# EAGLE design SparkFun-Blynk-Board-ESP8266 (EAGLE 7.5.0)
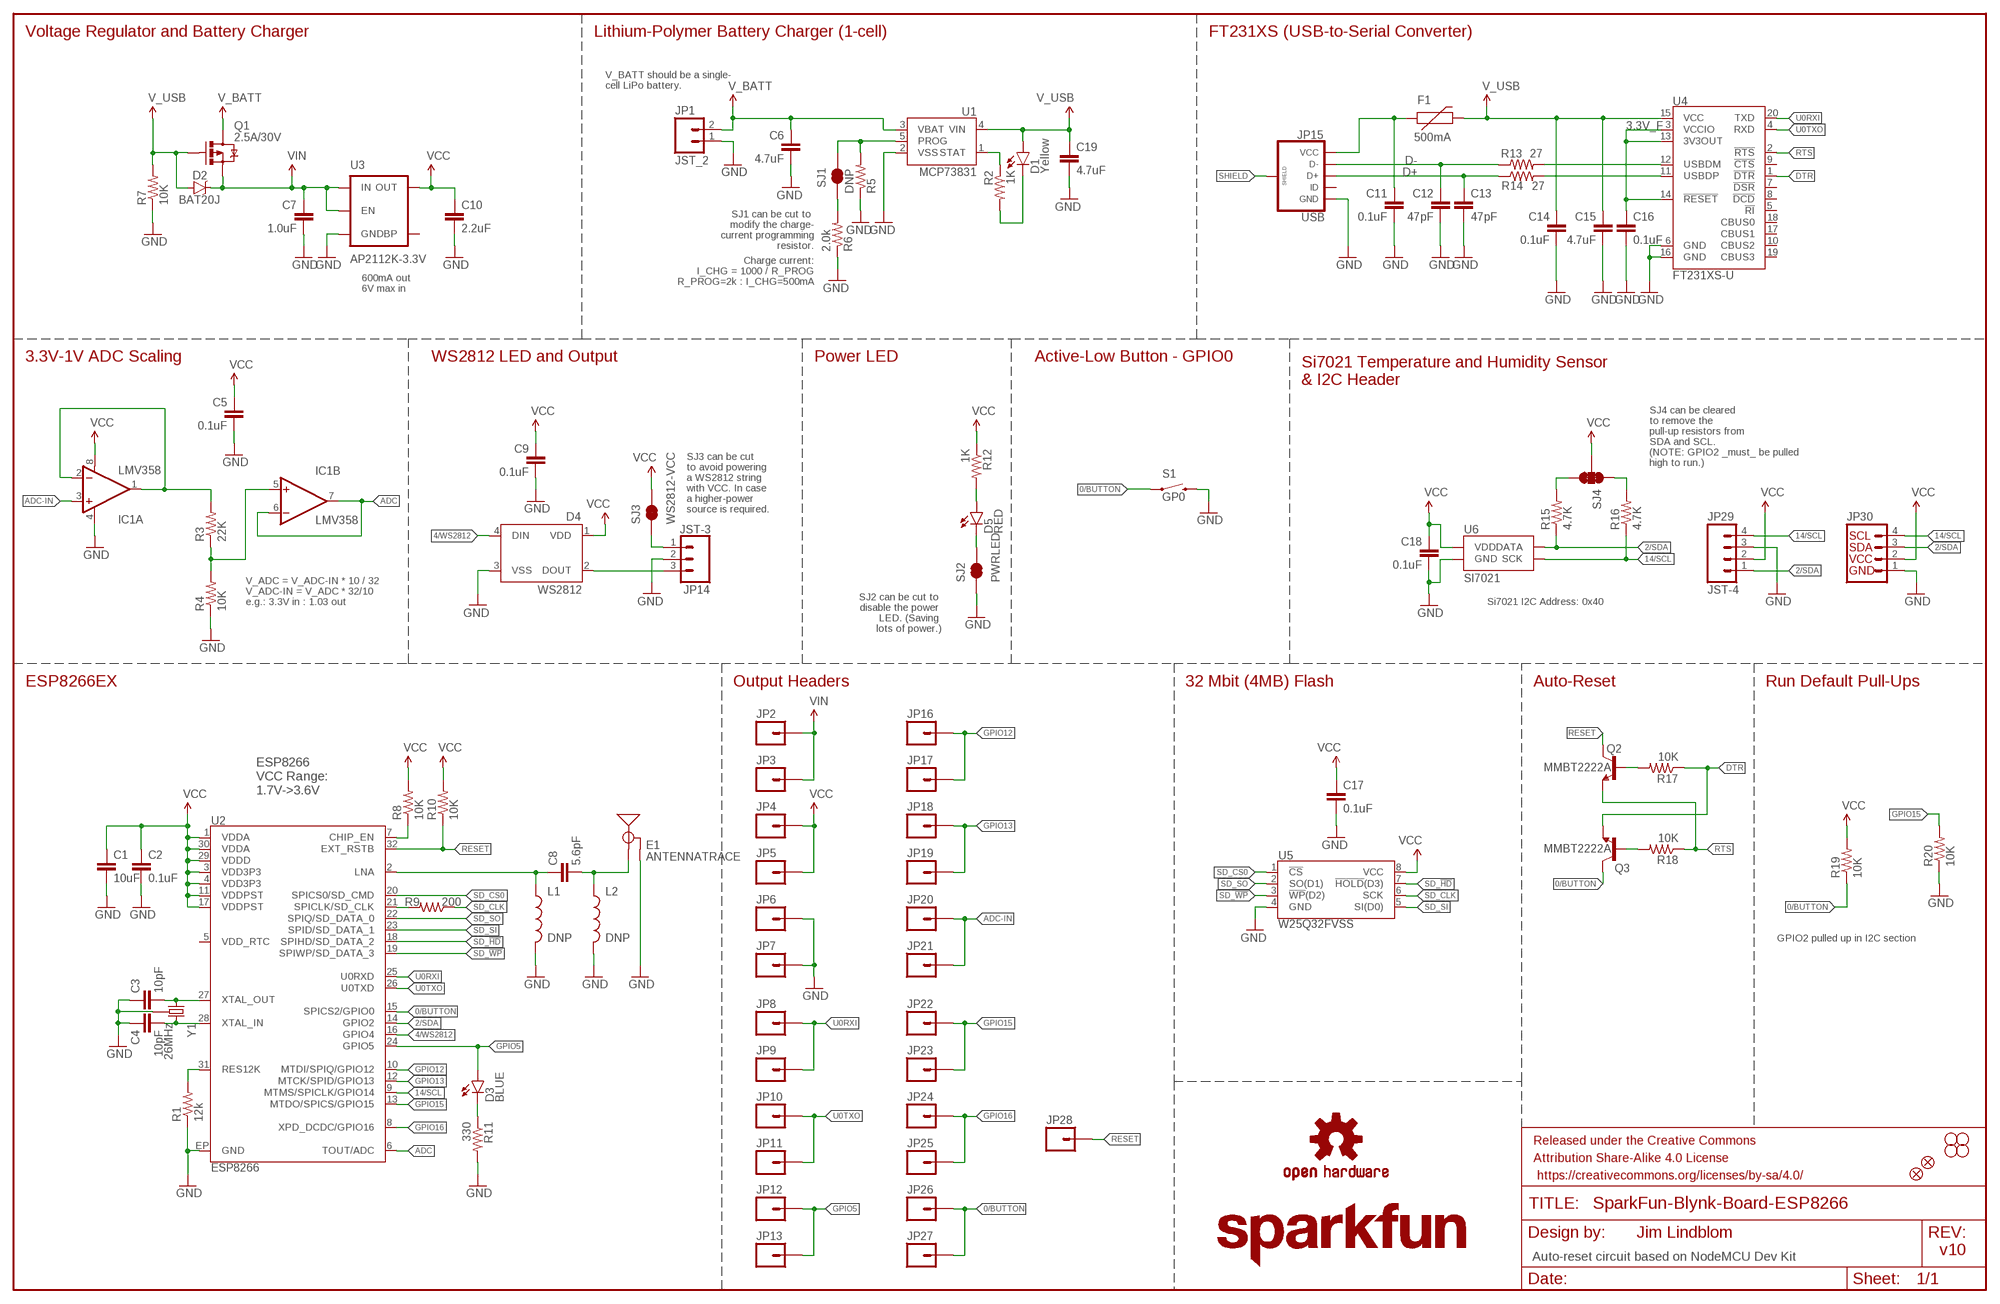
[diagram p0: schematic, sheet 1]

## Parts
C1  10uF  10UF-6.3V-20%(0603)  [0603-CAP]
C2  0.1uF  0.1UF-25V(+80/-20%)(0603)  [0603-CAP]
C3  10pF  10PF-50V-5%(0603)  [0603-CAP]
C4  10pF  10PF-50V-5%(0603)  [0603-CAP]
C5  0.1uF  0.1UF-25V(+80/-20%)(0603)  [0603-CAP]
C6  4.7uF  4.7UF-6.3V-10%(0603)0603  [0603-CAP]
C7  1.0uF  1.0UF-25V-+80/-20(0805)"  [0805-CAP]
C8  5.6pF  CAP0603-CAP  [0603-CAP]
C9  0.1uF  0.1UF-25V(+80/-20%)(0603)  [0603-CAP]
C10  2.2uF  2.2UF-10V-20%(0603)  [0603-CAP]
C11  0.1uF  0.1UF-25V(+80/-20%)(0603)  [0603-CAP]
C12  47pF  47PF-50V-5%(0603)  [0603-CAP]
C13  47pF  47PF-50V-5%(0603)  [0603-CAP]
C14  0.1uF  0.1UF-25V(+80/-20%)(0603)  [0603-CAP]
C15  4.7uF  4.7UF-6.3V-10%(0603)0603  [0603-CAP]
C16  0.1uF  0.1UF-25V(+80/-20%)(0603)  [0603-CAP]
C17  0.1uF  0.1UF-25V(+80/-20%)(0603)  [0603-CAP]
C18  0.1uF  0.1UF-25V(+80/-20%)(0603)  [0603-CAP]
C19  4.7uF  4.7UF-6.3V-10%(0603)0603  [0603-CAP]
D1  Yellow  LED-YELLOW0603  [LED-0603]
D2  BAT20J  DIODE-SCHOTTKY-BAT20J  [SOD-323]
D3  BLUE  LED-BLUE0603  [LED-0603]
D4  WS2812  WS2812B  [WS2812B]
D5  RED  LED-RED0603  [LED-0603]
E1  ANTENNATRACE  [TRACE_ANTENNA_2.4GHZ_25.7MM]
F1  500mA  PTCSMD  [PTC-1206]
FID1  FIDUCIAL1X2  [FIDUCIAL-1X2]
FID2  FIDUCIAL1X2  [FIDUCIAL-1X2]
FRAME1  FRAME-LEDGER  [CREATIVE_COMMONS]
IC1  LMV358  OPAMP-DUALU  [SO08]
JP1  JST_2  M02JST-PTH-2  [JST-2-PTH]
JP2  DNP  M01ALLIGATOR_HALF  [1X01_ALLIGATOR_3MM_HALF]
JP3  DNP  M01PTH_NO_SILK_YES_STOP  [1X01_NO_SILK]
JP4  DNP  M01ALLIGATOR_HALF  [1X01_ALLIGATOR_3MM_HALF]
JP5  DNP  M01PTH_NO_SILK_YES_STOP  [1X01_NO_SILK]
JP6  DNP  M01ALLIGATOR_HALF  [1X01_ALLIGATOR_3MM_HALF]
JP7  DNP  M01PTH_NO_SILK_YES_STOP  [1X01_NO_SILK]
JP8  DNP  M01ALLIGATOR_HALF  [1X01_ALLIGATOR_3MM_HALF]
JP9  DNP  M01PTH_NO_SILK_YES_STOP  [1X01_NO_SILK]
JP10  DNP  M01ALLIGATOR_HALF  [1X01_ALLIGATOR_3MM_HALF]
JP11  DNP  M01PTH_NO_SILK_YES_STOP  [1X01_NO_SILK]
JP12  DNP  M01ALLIGATOR_HALF  [1X01_ALLIGATOR_3MM_HALF]
JP13  DNP  M01PTH_NO_SILK_YES_STOP  [1X01_NO_SILK]
JP14  JST-3  M03JST-PTH-VERT  [JST-3-PTH-VERT]
JP15  USB  USB_MICROB_PLUGCONN-11752  [USB-B-MICRO-SMD_V03]
JP16  DNP  M01ALLIGATOR_HALF  [1X01_ALLIGATOR_3MM_HALF]
JP17  DNP  M01PTH_NO_SILK_YES_STOP  [1X01_NO_SILK]
JP18  DNP  M01ALLIGATOR_HALF  [1X01_ALLIGATOR_3MM_HALF]
JP19  DNP  M01PTH_NO_SILK_YES_STOP  [1X01_NO_SILK]
JP20  DNP  M01ALLIGATOR_HALF  [1X01_ALLIGATOR_3MM_HALF]
JP21  DNP  M01PTH_NO_SILK_YES_STOP  [1X01_NO_SILK]
JP22  DNP  M01ALLIGATOR_HALF  [1X01_ALLIGATOR_3MM_HALF]
JP23  DNP  M01PTH_NO_SILK_YES_STOP  [1X01_NO_SILK]
JP24  DNP  M01ALLIGATOR_HALF  [1X01_ALLIGATOR_3MM_HALF]
JP25  DNP  M01PTH_NO_SILK_YES_STOP  [1X01_NO_SILK]
JP26  DNP  M01ALLIGATOR_HALF  [1X01_ALLIGATOR_3MM_HALF]
JP27  DNP  M01PTH_NO_SILK_YES_STOP  [1X01_NO_SILK]
JP28  DNP  M01PTH_NO_SILK_YES_STOP  [1X01_NO_SILK]
JP29  JST-4  M04JST-PTH-VERT  [JST-4-PTH-VERT]
JP30  DNP  I2C_STANDARD_NO_SILK  [1X04_NO_SILK]
L1  DNP  INDUCTOR0603  [0603]
L2  DNP  INDUCTOR0603  [0603]
LOGO1  SFE_LOGO_NAME.2_INCH  [SFE_LOGO_NAME_.2]
LOGO2  OSHW-LOGOS  [OSHW-LOGO-S]
LOGO3  SFE_LOGO_NAME.3_INCH  [SFE_LOGO_NAME_.3]
Q1  2.5A/30V  MOSFET-PCHANNELDMG2307L  [SOT23-3]
Q2  MMBT2222A  TRANSISTOR_NPNMMBT2222A  [SOT23-3@1]
Q3  MMBT2222A  TRANSISTOR_NPNMMBT2222A  [SOT23-3@1]
R1  12k  12KOHM-1/10W-1%(0603)  [0603-RES]
R2  1K  1KOHM-1/10W-1%(0603)  [0603-RES]
R3  22K  22KOHM1/10W1%(0603)  [0603-RES]
R4  10K  10KOHM-1/10W-1%(0603)0603  [0603-RES]
R5  DNP  RESISTORPTH-1/6W  [1/6W-RES]
R6  2.0k  2.0KOHM1/10W5%(0603)  [0603-RES]
R7  10K  10KOHM1/10W1%(0603)0603  [0603-RES@1]
R8  10K  10KOHM1/10W1%(0603)0603  [0603-RES@1]
R9  200  200OHM1/10W1%(0603)  [0603-RES]
R10  10K  10KOHM1/10W1%(0603)0603  [0603-RES@1]
R11  330  330OHM1/10W1%(0603)  [0603-RES]
R12  1K  1KOHM-1/10W-1%(0603)  [0603-RES]
R13  27  27OHM1/10W1%(0603)0603-RES  [0603-RES]
R14  27  27OHM1/10W1%(0603)0603-RES  [0603-RES]
R15  4.7K  4.7KOHM-1/10W-1%(0603)  [0603-RES]
R16  4.7K  4.7KOHM-1/10W-1%(0603)  [0603-RES]
R17  10K  10KOHM1/10W1%(0603)0603  [0603-RES@1]
R18  10K  10KOHM1/10W1%(0603)0603  [0603-RES@1]
R19  10K  10KOHM1/10W1%(0603)0603  [0603-RES@1]
R20  10K  10KOHM1/10W1%(0603)0603  [0603-RES@1]
S1  GP0  SWITCH-MOMENTARY-2SMD-REDUNDANT  [TACTILE-SWITCH-SMD]
SJ1  DNP  JUMPER-PAD-2-NC_BY_TRACE  [PAD-JUMPER-2-NC_BY_TRACE_YES_SILK]
SJ2  PWRLED  JUMPER-PAD-2-NC_BY_TRACE  [PAD-JUMPER-2-NC_BY_TRACE_YES_SILK]
SJ3  WS2812-VCC  JUMPER-PAD-2-NC_BY_TRACE  [PAD-JUMPER-2-NC_BY_TRACE_YES_SILK]
SJ4  DNP  JUMPER-PAD-3-NC_BY_TRACE  [PAD-JUMPER-3-3OF3_NC_BY_TRACE_YES_SILK_FULL_BOX]
STANDOFF1  STAND-OFF  [STAND-OFF]
STANDOFF2  STAND-OFF  [STAND-OFF]
STANDOFF3  STAND-OFF  [STAND-OFF]
STANDOFF4  STAND-OFF  [STAND-OFF]
U1  MCP73831  [SOT23-5]
U2  ESP8266  [QFN32]
U3  AP2112K-3.3V  V_REG_LDOSMD  [SOT23-5]
U4  FT231XS-U  FT231XS  [SSOP20_L]
U5  W25Q32FVSS  [SOIC-8]
U6  SI7021  [SI7021]
Y1  26MHz  CRYSTAL-GROUNDED3.2X2.5  [CRYSTAL-SMD-3.2X2.5]

## Nets
0/BUTTON: JP26.1@2 JP27.1 Q3.3(C) R19.1 S1.1 S1.2 U2.15(SPICS2/GPIO0)
2/SDA: JP29.1 JP30.3 R15.1 U2.14(GPIO2) U6.DATA
3.3V_F: C16.1 U4.3(VCCIO) U4.13(3V3OUT) U4.14(!RESET)
4/WS2812: D4.4(DIN) U2.16(GPIO4)
14/SCL: JP29.4 JP30.4 R16.1 U2.9(MTMS/SPICLK/GPIO14) U6.SCK
ADC: IC1.6(B:-IN) IC1.7(B:OUT) U2.6(TOUT/ADC)
ADC-IN: IC1.3(A:+IN) JP20.1@2 JP21.1
CHIP_EN: R8.1 U2.7(CHIP_EN)
D+: C13.1 JP15.D+ R14.1
D-: C12.1 JP15.D- R13.1
DTR: Q3.2(E) R17.1 U4.1(!DTR)
GND: C1.2 C2.2 C3.1 C4.1 C5.2 C6.2 C7.2 C9.2 C10.2 C11.2 C12.2 C13.2 C14.2 C15.2 C16.2 C17.2 C18.2 C19.2 D4.3(VSS) E1.GND E1.GND2(GND) IC1.4(A:V-) JP1.1 JP6.1@2 JP7.1 JP14.2 JP15.GND JP29.3 JP30.1 L1.2 L2.2 R1.1 R4.1 R5.1 R6.1 R7.1 R11.2 R20.1 S1.3 S1.4 SJ2.1 U1.2(VSS) U2.EP(GND) U3.2(GND) U4.6(GND) U4.16(GND) U5.4(GND) U6.GND Y1.2(GND) Y1.4(GND)
GPIO5: D3.A JP12.1@2 JP13.1 U2.24(GPIO5)
GPIO12: JP16.1@2 JP17.1 U2.10(MTDI/SPIQ/GPIO12)
GPIO13: JP18.1@2 JP19.1 U2.12(MTCK/SPID/GPIO13)
GPIO15: JP22.1@2 JP23.1 R20.2 U2.13(MTDO/SPICS/GPIO15)
GPIO16: JP24.1@2 JP25.1 U2.8(XPD_DCDC/GPIO16)
LNA: C8.1 L1.1 U2.2(LNA)
N$1: R1.2 U2.31(RES12K)
N$2: C4.2 U2.28(XTAL_IN) Y1.3
N$3: C3.2 U2.27(XTAL_OUT) Y1.1
N$4: R13.2 U4.12(USBDM)
N$5: D5.C SJ2.2
N$6: Q2.1(B) R17.2
N$7: R14.2 U4.11(USBDP)
N$8: D3.C R11.1
N$9: R2.1 U1.1(STAT)
N$10: D5.A R12.2
N$11: R15.2 SJ4.3
N$12: Q3.1(B) R18.2
N$13: R16.2 SJ4.1
N$14: R5.2 SJ1.2 U1.5(PROG)
N$15: IC1.1(A:OUT) IC1.2(A:-IN) R3.2
N$16: R6.2 SJ1.1
N$17: D1.C R2.2
N$18: IC1.5(B:+IN) R3.1 R4.2
N$19: JP14.1 SJ3.1
RESET: JP28.1 Q2.3(C) R10.1 U2.32(EXT_RSTB)
RTS: Q2.2(E) R18.1 U4.2(!RTS)
SD_!HD!: U2.18(SPIHD/SD_DATA_2) U5.7(!HOLD!(D3))
SD_!WP!: U2.19(SPIWP/SD_DATA_3) U5.3(!WP!(D2))
SD_CLK: R9.1 U5.6(SCK)
SD_CLK0: R9.2 U2.21(SPICLK/SD_CLK)
SD_CS0: U2.20(SPICS0/SD_CMD) U5.1(!CS!)
SD_SI: U2.23(SPID/SD_DATA_1) U5.5(SI(D0))
SD_SO: U2.22(SPIQ/SD_DATA_0) U5.2(SO(D1))
SHIELD: JP15.SHIELD1(SHIELD) JP15.SHIELD2(SHIELD) JP15.SHIELD3(SHIELD)
TRACE_ANT: C8.2 E1.ANT(SIGNAL) L2.1
U0RXI: JP8.1@2 JP9.1 U2.25(U0RXD) U4.20(TXD)
U0TXO: JP10.1@2 JP11.1 U2.26(U0TXD) U4.4(RXD)
V_BATT: C6.1 JP1.2 Q1.3(D) U1.3(VBAT)
V_USB: C14.1 C15.1 C19.1 D1.A D2.A F1.2 Q1.1(G) R7.2 U1.4(VIN) U4.15(VCC)
VCC: C1.1 C2.1 C5.1 C9.1 C10.1 C17.1 C18.1 D4.1(VDD) IC1.8(A:V+) JP4.1@2 JP5.1 JP29.2 JP30.2 R8.2 R10.2 R12.1 R19.2 SJ3.2 SJ4.2 U2.1(VDDA) U2.3(VDD3P3) U2.4(VDD3P3) U2.11(VDDPST) U2.17(VDDPST) U2.29(VDDD) U2.30(VDDA) U3.5(OUT) U5.8(VCC) U6.VDD
VIN: C7.1 D2.C JP2.1@2 JP3.1 Q1.2(S) U3.1(IN) U3.3(EN)
VUSB: C11.1 F1.1 JP15.VBUS(VCC)
WS2812-DOUT: D4.2(DOUT) JP14.3
Unconnected: JP15.ID U2.5(VDD_RTC) U3.4(BP) U4.5(!RI) U4.7(!DSR) U4.8(!DCD) U4.9(!CTS) U4.10(CBUS2) U4.17(CBUS1) U4.18(CBUS0) U4.19(CBUS3)

## Notes on the sheet
- Voltage Regulator and Battery Charger | Lithium-Polymer Battery Charger (1-cell) | FT231XS (USB-to-Serial Converter)
- V_BATT should be a single-
  cell LiPo battery.
- SJ1 can be cut to 
  modify the charge-
  current programming
  resistor.
- Charge current:
  I_CHG = 1000 / R_PROG
  R_PROG=2k : I_CHG=500mA
- 600mA out
  6V max in
- 3.3V-1V ADC Scaling | WS2812 LED and Output | Power LED | Active-Low Button - GPIO0
- Si7021 Temperature and Humidity Sensor
  & I2C Header
- SJ4 can be cleared
  to remove the
  pull-up resistors from
  SDA and SCL.
  (NOTE: GPIO2 _must_ be pulled
  high to run.)
- SJ3 can be cut 
  to avoid powering 
  a WS2812 string 
  with VCC. In case 
  a higher-power 
  source is required.
- SJ2 can be cut to 
  disable the power 
  LED. (Saving 
  lots of power.)
- V_ADC = V_ADC-IN * 10 / 32
  V_ADC-IN = V_ADC * 32/10
  e.g.: 3.3V in : 1.03 out
- Si7021 I2C Address: 0x40
- ESP8266EX | Output Headers | 32 Mbit (4MB) Flash | Auto-Reset | Run Default Pull-Ups
- ESP8266
  VCC Range:
  1.7V->3.6V
- GPIO2 pulled up in I2C section
- Jim Lindblom
- v10
- Auto-reset circuit based on NodeMCU Dev Kit

## Library data of the parts
C1 = SparkFun-Capacitors:10UF-6.3V-20%(0603): CAP-11015; PROD_ID: CAP-11015
C2 C5 C9 C11 C14 C16-C18 = SparkFun-Capacitors:0.1UF-25V(+80/-20%)(0603): CAP-00810 Ceramic Standard decoupling cap; PROD_ID: CAP-00810
C3 C4 = SparkFun-Capacitors:10PF-50V-5%(0603): CAP-11812; PROD_ID: CAP-11812
C6 C15 C19 = SparkFun-Capacitors:4.7UF-6.3V-10%(0603): CAP-08280; PROD_ID: CAP-08280
C7 = SparkFun-Capacitors:1.0UF-25V-+80/-20(0805): CAP-11625; PROD_ID: CAP-11625
C8 = SparkFun-Capacitors:CAP: Capacitor Standard 0603 ceramic capacitor, and 0.1" leaded capacitor.; PROD_ID: CAP-12456
C10 = SparkFun-Capacitors:2.2UF-10V-20%(0603): CAP-07888; PROD_ID: CAP-07888
C12 C13 = SparkFun-Capacitors:47PF-50V-5%(0603): CAP-08913; PROD_ID: CAP-08913
D1 = SparkFun-LED:LED-YELLOW: Yellow SMD LEDs LilyPad 1206- DIO-09909 0603- DIO-09003 "SMART" means more efficient and expensive; PROD_ID: DIO-09003
D2 = SparkFun-DiscreteSemi:DIODE-SCHOTTKY: Schottky diodes in SFE's production catalog BAT20J 1A 23V 0.62Vf RB751 120mA 40V 0.37Vf PMEG4005EJ 0.5A 40V 0.42Vf MBRA140 1A 40V 0.5Vf B340A 3A 40V SMA; PROD_ID: DIO-11623
D3 = SparkFun-LED:LED-BLUE: Blue LEDs for production use Various blue LEDs stocked by SparkFun production 0603 - DIO-08575 Rebel - DIO-09553 1206 - DIO-09911; PROD_ID: DIO-08575
D4 = SparkFun-LED:WS2812B: WS2812B - Intelligent control LED integrated light source Technical Specifications: Power Supply Voltage (VDD): 3.5 to 5.3 V Input Voltage (VI): -0.5 to VDD+0.5 V Operating Junction Temperature (Topt): -25°C to +80°C Storage Temperature Range (Tstg): -55°C to +150°C; PROD_ID: DIO-12503
D5 = SparkFun-LED:LED-RED: Assorted Red LEDs LilyPad 1206- DIO-09912 1206- DIO-00809 0603- DIO-00819 "SMART" means more efficient and expensive; PROD_ID: DIO-00819
E1 = SparkFun-RF:ANTENNA: Chip antenna Chip antenna with ground or secondary connection. Common with larger metal RF connectors.
F1 = SparkFun-PowerIC:PTC: Resettable Fuse PTC Resettable Fuse. Spark Fun Electronics SKU : COM-08357; PROD_ID: RES-11150
FID1 FID2 = SparkFun-Aesthetics:FIDUCIAL: Fiducial Alignment Points Various fiducial points for machine vision alignment.
FRAME1 = SparkFun-Aesthetics:FRAME-LEDGER: Schematic Frame Standard 11x14 US Ledger frame
IC1 = SparkFun-AnalogIC:OPAMP-DUAL: Generic op-amp footprint; PROD_ID: IC-09657
JP1 = SparkFun-Connectors:M02: Standard 2-pin 0.1" header. Use with - straight break away headers ( PRT-00116) - right angle break away headers (PRT-00553) - swiss pins (PRT-00743) - machine pins (PRT-00117) - female headers (PRT-00115) Molex polarized connector foot print use with: PRT-08233 with associated crimp pins and housings. 2.54_SCREWTERM for use with PRT-10571. 3.5mm Screw Terminal footprints for PRT-08084 5mm Screw Terminal footprints for use with PRT-08432; PROD_ID: CONN-09863; SKU: PRT-09914
JP2 JP4 JP6 JP8 JP10 JP12 JP16 JP18 JP20 JP22 JP24 JP26 = blynk-thing-temp:M01: Header 1
JP3 JP5 JP7 JP9 JP11 JP13 JP17 JP19 JP21 JP23 JP25 JP27 JP28 = SparkFun-Connectors:M01: Header 1
JP14 = SparkFun-Connectors:M03: Header 3 Standard 3-pin 0.1" header. Use with straight break away headers (SKU : PRT-00116), right angle break away headers (PRT-00553), swiss pins (PRT-00743), machine pins (PRT-00117), and female headers (PRT-00115). Molex polarized connector foot print use with SKU : PRT-08232 with associated crimp pins and housings.; PROD_ID: CONN-13230
JP15 = SparkFun-Connectors:USB_MICROB_PLUG: USB Micro-B connectors Some male, some female. Watch your step!; PROD_ID: CONN-11752
JP29 = SparkFun-Connectors:M04: Header 4 Standard 4-pin 0.1" header. Use with straight break away headers (SKU : PRT-00116), right angle break away headers (PRT-00553), swiss pins (PRT-00743), machine pins (PRT-00117), and female headers (PRT-00115). Molex polarized connector foot print use with SKU : PRT-08231 with associated crimp pins and housings. 1MM SMD Version SKU: PRT-10208; PROD_ID: CONN-13251
JP30 = SparkFun-Connectors:I2C_STANDARD: SparkFun has standardized on a pinout for all I2C based sensor breakouts. This pinout allows I2C boards to be plugged directly into the headers on Arduino Uno compatible boards, and to be daisy chained easily.
L1 L2 = SparkFun-Passives:INDUCTOR: Inductors Basic Inductor/Choke - 0603 and 1206. Footprints are not proven and vary greatly between part numbers. INDUCTOR POWER 3.3UH 4.0A SMD 0.197" L x 0.197" W x 0.177" H (5.00mm x 5.00mm x 4.50mm)
LOGO1 LOGO3 = SparkFun-Aesthetics:SFE_LOGO_NAME: SFE Logo, name only This is the SparkFun name logo. The logo on the schematic will always be the same size; the package variant is the height of the flame part of the logo (or the height the flame would be, if it were drawn). Default layer for the logo on the board is tSilk.
LOGO2 = SparkFun-Aesthetics:OSHW-LOGO: Open Source Hardware Logo This logo indicates the piece of hardware it is found on incorporates a OSHW license and/or adheres to the definition of open source hardware found here: http://freedomdefined.org/OSHW
Q1 = SparkFun-DiscreteSemi:MOSFET-PCHANNEL: Generic PMOSFET IRLML2244 - TRANS-11153 (SOT-23 -20V -4.3A) (1.Gate 2.Source 3.Drain) FQP27P06 - COM-10349 <http://www.sparkfun.com/products/10349> (TO-220 -60V -27A) (1.Gate 2.Source 3.Drain); PROD_ID: TRANS-11308
Q2 Q3 = SparkFun-DiscreteSemi:TRANSISTOR_NPN: Generic NPN BJT MMBT2222A - TRANS-08049 (SOT-23, 1A 40V) MPSA42 - TRANS-09116 (SOT-23, 500mA 300V) MMBT5088LT1G - TRANS-11160 (SOT-23, 50 mA 30V) BC547 - COM-08928 <http://www.sparkfun.com/products/8928> (TO-92 45V 100mA) (1.Collector 2.Base 3.Emitter) 2N3904 - COM-00521 <http://www.sparkfun.com/products/521> (TO-92 40V 200mA) (1.Emitter 2.Base 3.Collector) P2N2222A - COM-12852 <http://www.sparkfun.com/products/12852> (TO-92 40V 600mA) (1.Collector 2.Base 3.Emitter); PROD_ID: TRANS-08049
R1 = SparkFun-Resistors:12KOHM-1/10W-1%(0603): RES-10327; PROD_ID: RES-10327
R2 R12 = SparkFun-Resistors:1KOHM-1/10W-1%(0603): RES-07856; PROD_ID: RES-07856
R3 = SparkFun-Resistors:22KOHM1/10W1%(0603): RES-07853; PROD_ID: RES-07853
R4 = SparkFun-Resistors:10KOHM-1/10W-1%(0603): RES-00824; PROD_ID: RES-00824
R5 = SparkFun-Passives:RESISTOR: Resistor Basic schematic elements and footprints for 0603, 1206, and PTH resistors.
R6 = SparkFun-Resistors:2.0KOHM1/10W5%(0603): RES-08296; PROD_ID: RES-08296
R7 R8 R10 R17-R20 = SparkFun-Resistors:10KOHM1/10W1%(0603): RES-00824; PROD_ID: RES-00824
R9 = SparkFun-Resistors:200OHM1/10W1%(0603): RES-08220; PROD_ID: RES-08220
R11 = SparkFun-Resistors:330OHM1/10W1%(0603): RES-00818; PROD_ID: RES-00818
R13 R14 = SparkFun-Resistors:27OHM1/10W1%(0603): RES-09334; PROD_ID: RES-09334
R15 R16 = SparkFun-Resistors:4.7KOHM-1/10W-1%(0603): RES-07857; PROD_ID: RES-07857
S1 = SparkFun-Electromechanical:SWITCH-MOMENTARY-2: Various NO switches- pushbuttons, reed, etc; PROD_ID: SWCH-08247
SJ1-SJ3 = SparkFun-Passives:JUMPER-PAD-2-NC_BY_TRACE
SJ4 = SparkFun-Passives:JUMPER-PAD-3-NC_BY_TRACE
STANDOFF1-STANDOFF4 = SparkFun-Electromechanical:STAND-OFF: #4 Stand Off This is the mechanical footprint for a #4 phillips button head screw. Use the keepout ring to avoid running the screw head into surrounding components. SKU : PRT-00447
U1 = SparkFun-PowerIC:MCP73831: Miniature single cell, fully integrated Li-Ion, Li-polymer charge management controller http://ww1.microchip.com/downloads/en/DeviceDoc/20001984g.pdf IC-09995; PROD_ID: IC-09995
U2 = SparkFun-RF:ESP8266: Espressif ESP8266 WiFi Smart Connectivity Platform.; PROD_ID: IC-12452
U3 = SparkFun-PowerIC:V_REG_LDO: Voltage Regulator LDO Standard 150mA LDO voltage regulator in SOT-23 layout. Micrel part MIC5205. BP (by-pass) pin is used to lower output noise with 470pF cap.; PROD_ID: VREG-12457
U4 = SparkFun-DigitalIC:FT231X: FTDI FT231X Full Speed USB to Full-handshake UART This USB2.0 Full Speed IC offers a compact bridge to full handshake UART interfaces. The device is a UART, capable of operating up to 3MBaud, with low power consumption (8mA). The FT231X includes the complete FT-X series feature set and enables USB to be added into a system design quickly and easily over a UART interface.; PROD_ID: IC-11524; VALUE: FTS31XS-U
U5 = blynk-thing-temp:W25Q32FV; PROD_ID: IC-13229
U6 = SparkFun-Sensors:SI7021: The Si7021 is an I2C Humidity and Temperature Sensor; PROD_ID: IC-13093
Y1 = things:CRYSTAL-GROUNDED; PROD_ID: XTAL-12454

## Board
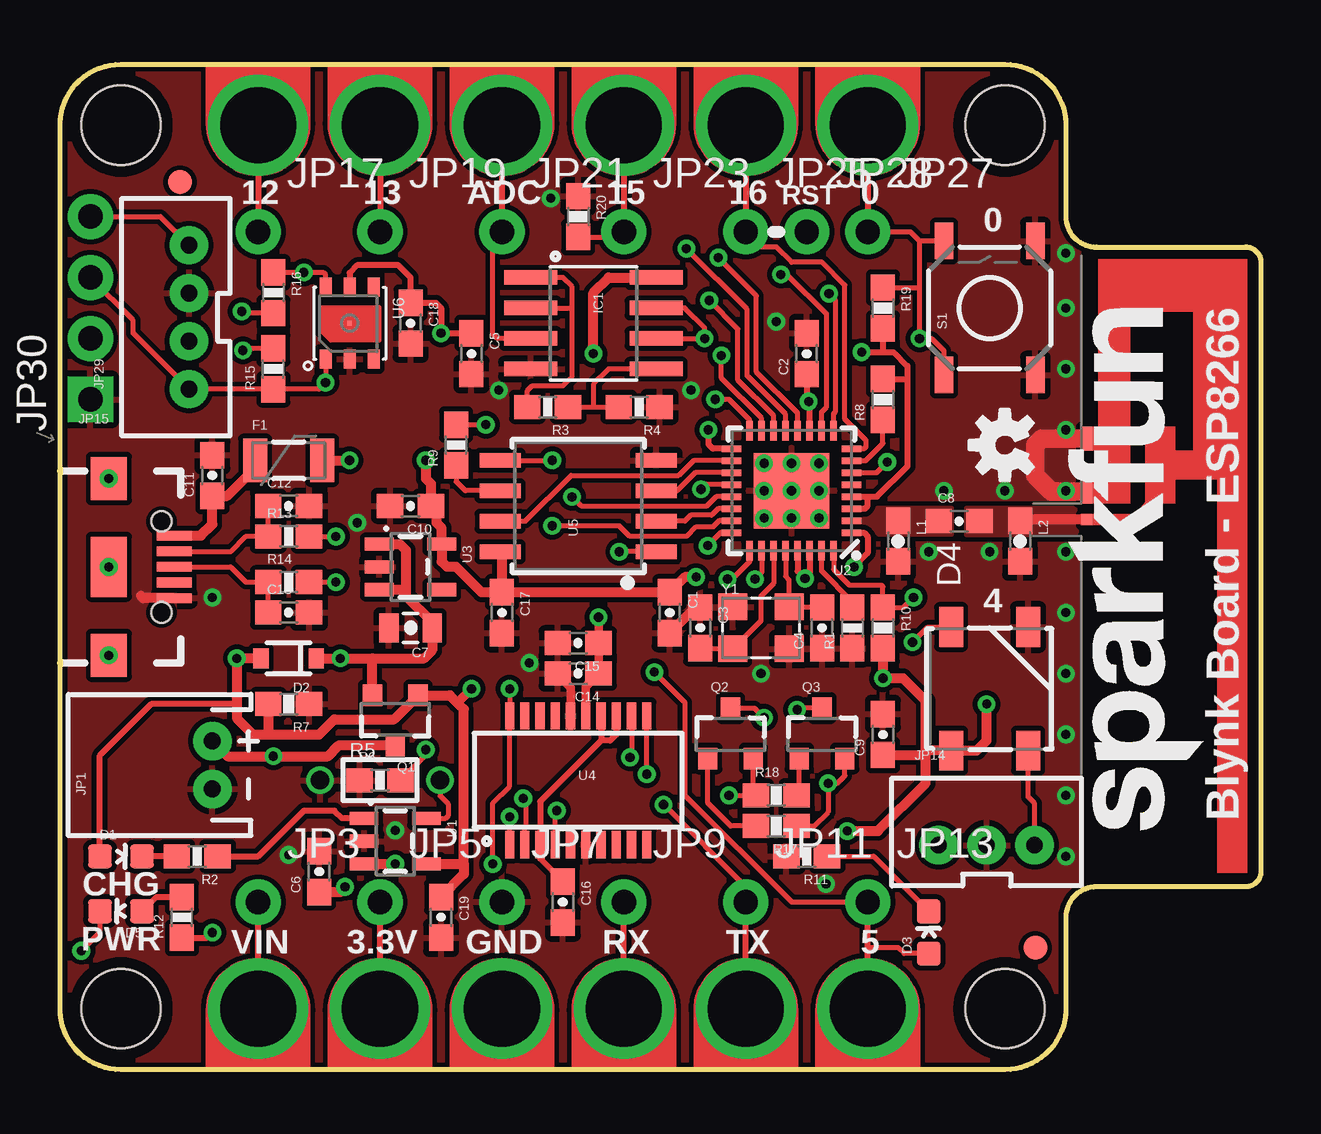
[diagram p1: board, top side]
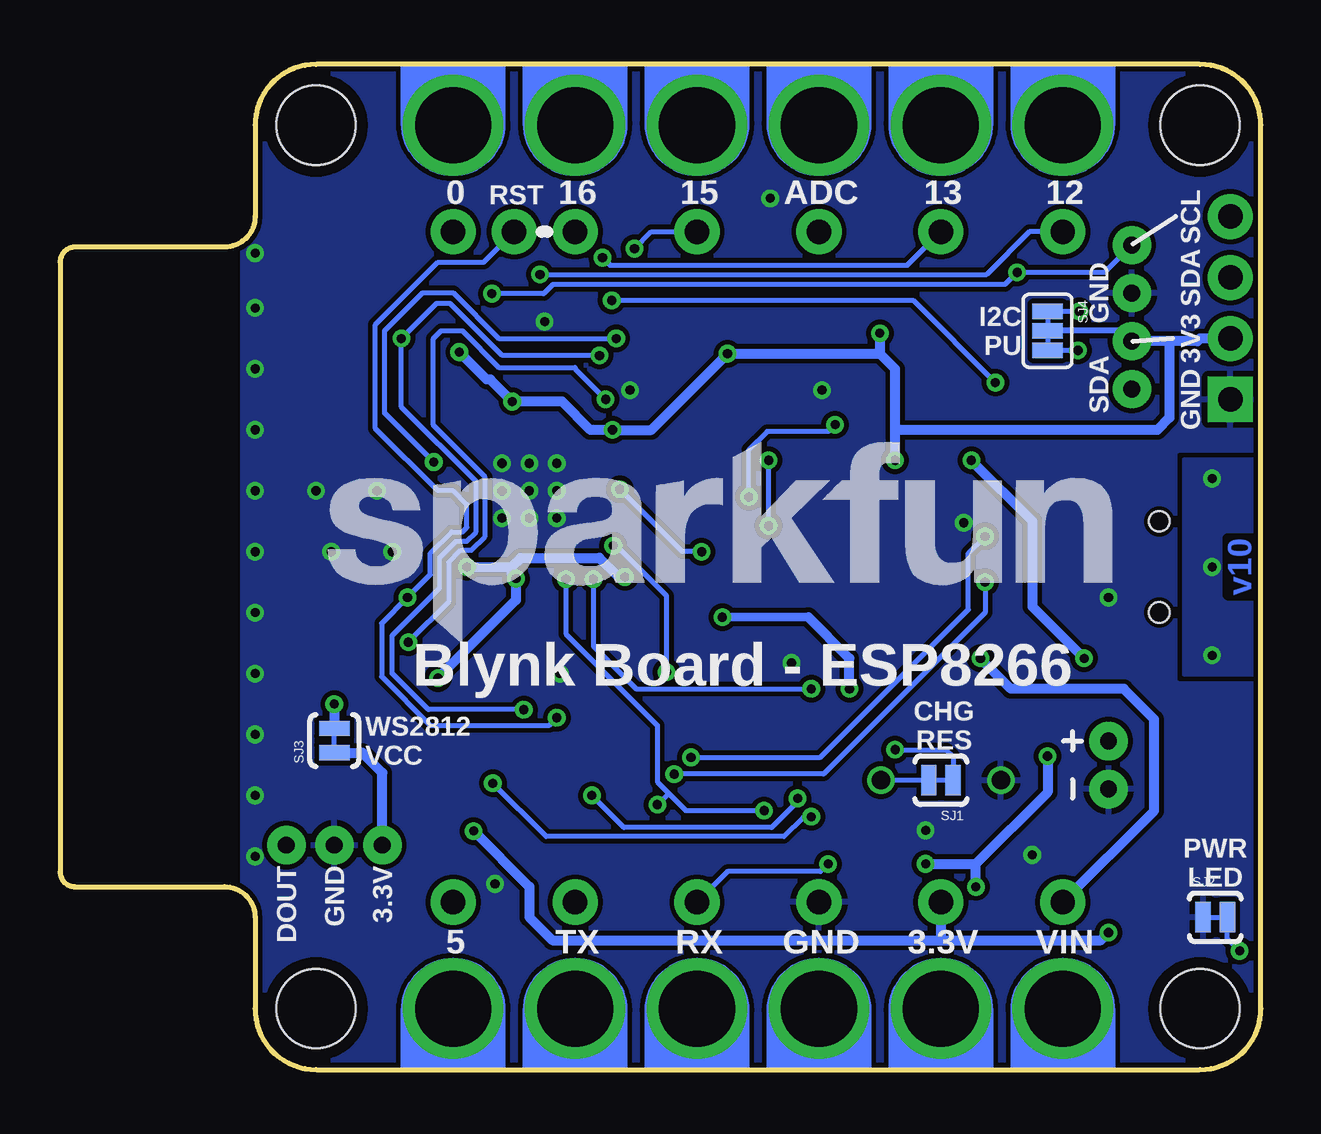
[diagram p2: board, bottom side, seen from below]

Size 50.04 x 41.91 mm. Coordinates in mm from the lower left corner, seen from the top.
Outline: 0,2.54 0,39.37 arc-90 2.54,41.91 39.37,41.91 arc-90 41.91,39.37 41.91,35.56 arc90 43.18,34.29 49.4,34.29 arc-90 50.04,33.66 50.04,8.26 arc-90 49.4,7.62 43.18,7.62 arc90 41.91,6.35 41.91,2.54 arc-90 39.37,0 2.54,0 arc-90 0,2.54
Copper layers (1*16): Top 0.035mm / dielectric 1.5mm / Bottom 0.035mm
Design rules "SparkFun-2-layer-TIGHT": minimum track width 7mil, minimum drill 15mil, track to track 7mil, track to pad 7mil, pad to pad 7mil, via to via 7mil, smd to smd 7mil, copper to edge 7mil, drill to drill 7mil, minimum pad ring 7mil, minimum via ring 7mil, stop-mask expansion 4mil, vias tented up to drill 20mil, thermal gap 10mil

### Footprints (pad centres in the part's own frame; a part is rotated, then mirrored left to right if it is on the bottom)
0603-CAP = smd 1.1 x 1: 1 -0.85,0; 2 0.85,0
0805-CAP = smd 0.8 x 1.2: 1 -0.9,0; 2 0.9,0
LED-0603 = smd 1 x 1: A 0,-0.877; C 0,0.877
SOD-323 = smd 0.63 x 0.83: A 1.15,0; C -1.15,0
WS2812B = smd 1.651 x 1: 1 -2.577,1.6; 2 -2.577,-1.6; 3 2.577,-1.6; 4 2.577,1.6
TRACE_ANTENNA_2.4GHZ_25.7MM = smd 0.46 x 0.46: ANT 0,0.23 | smd 1 x 0.46: GND -1.18,0.23; GND2 -3.38,0.23
PTC-1206 = smd 1 x 1.8: 1 -1.4,0; 2 1.4,0
FIDUCIAL-1X2 = smd 1 x 1: 1 0,0
SO08 = smd 0.61 x 2.21: 1 -1.905,-2.616; 2 -0.635,-2.616; 3 0.635,-2.616; 4 1.905,-2.616; 5 1.905,2.616; 6 0.635,2.616; 7 -0.635,2.616; 8 -1.905,2.616
JST-2-PTH = drill 0.7 pad 1.6: 1 -1,0; 2 1,0
1X01_ALLIGATOR_3MM_HALF = drill 3.175: 1@2 0,0
1X01_NO_SILK = drill 1.016 pad 1.88: 1 0,0
JST-3-PTH-VERT = drill 0.7 pad 1.6: 1 -2,-0.55; 2 0,-0.55; 3 2,-0.55
USB-B-MICRO-SMD_V03 = smd 1.45 x 0.4: D+ 2.725,0; D- 2.725,0.65; GND 2.725,-1.3; ID 2.725,-0.65; VBUS 2.725,1.3 | smd 1.5 x 1.8: SHIELD1 0,3.685; SHIELD2 0,-3.685 | smd 1.5 x 2.5: SHIELD3 0,0 | hole 0.85: 2.2,1.9; 2.2,-1.9
JST-4-PTH-VERT = drill 0.7 pad 1.6: 1 -3,-0.55; 2 -1,-0.55; 3 1,-0.55; 4 3,-0.55
1X04_NO_SILK = drill 1.016 pad 1.88 square: 1 0,0 | drill 1.016 pad 1.88: 2 2.54,0; 3 5.08,0; 4 7.62,0
0603 = smd 1.1 x 1: 1 -0.85,0; 2 0.85,0
SOT23-3 = smd 0.8 x 0.9: 1 -0.95,-1; 2 0.95,-1; 3 0,1.1
SOT23-3@1 = smd 0.8 x 0.9: 1 -0.95,-1; 2 0.95,-1; 3 0,1.1
0603-RES = smd 1.1 x 1: 1 -0.85,0; 2 0.85,0
1/6W-RES = drill 0.762: 1 -2.5,0; 2 2.5,0
0603-RES@1 = smd 1.1 x 1: 1 -0.85,0; 2 0.85,0
TACTILE-SWITCH-SMD = smd 1.524 x 0.762: 1 -2.794,1.905; 2 2.794,1.905; 3 -2.794,-1.905; 4 2.794,-1.905
PAD-JUMPER-2-NC_BY_TRACE_YES_SILK = smd 0.635 x 1.27: 1 -0.508,0; 2 0.508,0
PAD-JUMPER-3-3OF3_NC_BY_TRACE_YES_SILK_FULL_BOX = smd 0.635 x 1.27: 1 -0.813,0; 2 0,0; 3 0.813,0
STAND-OFF = hole 3.302: 0,0
SOT23-5 = smd 0.55 x 1.2: 1 -0.95,-1.3; 2 0,-1.3; 3 0.95,-1.3; 4 0.95,1.3; 5 -0.95,1.3
QFN32 = smd 0.8 x 0.285: 1 -2.5,1.75; 2 -2.5,1.25; 3 -2.5,0.75; 4 -2.5,0.25; 5 -2.5,-0.25; 6 -2.5,-0.75; 7 -2.5,-1.25; 8 -2.5,-1.75; 17 2.5,-1.75; 18 2.5,-1.25; 19 2.5,-0.75; 20 2.5,-0.25; 21 2.5,0.25; 22 2.5,0.75; 23 2.5,1.25; 24 2.5,1.75 | smd 0.285 x 0.8: 9 -1.75,-2.5; 10 -1.25,-2.5; 11 -0.75,-2.5; 12 -0.25,-2.5; 13 0.25,-2.5; 14 0.75,-2.5; 15 1.25,-2.5; 16 1.75,-2.5; 25 1.75,2.5; 26 1.25,2.5; 27 0.75,2.5; 28 0.25,2.5; 29 -0.25,2.5; 30 -0.75,2.5; 31 -1.25,2.5; 32 -1.75,2.5 | smd 3.15 x 3.15: EP 0,0
SSOP20_L = smd 0.381 x 1.143: 1 -2.857,-2.68; 2 -2.223,-2.68; 3 -1.587,-2.68; 4 -0.953,-2.68; 5 -0.318,-2.68; 6 0.318,-2.68; 7 0.953,-2.68; 8 1.587,-2.68; 9 2.223,-2.68; 10 2.857,-2.68; 11 2.857,2.68; 12 2.223,2.68; 13 1.587,2.68; 14 0.953,2.68; 15 0.318,2.68; 16 -0.318,2.68; 17 -0.953,2.68; 18 -1.587,2.68; 19 -2.223,2.68; 20 -2.857,2.68
SOIC-8 = smd 0.61 x 1.702: 1 -1.905,-3.251; 2 -0.635,-3.251; 3 0.635,-3.251; 4 1.905,-3.251; 5 1.905,3.251; 6 0.635,3.251; 7 -0.635,3.251; 8 -1.905,3.251
SI7021 = smd 0.2 x 0.2: 7 0,0 | smd 0.8 x 0.5: DATA 1.5,-1; GND 1.5,0; NC@3 1.5,1; NC@4 -1.5,1; SCK -1.5,-1; VDD -1.5,0
CRYSTAL-SMD-3.2X2.5 = smd 1.2 x 1.1: 1 -1.175,-0.875; 2 1.175,-0.875; 3 1.175,0.875; 4 -1.175,0.875

### Placement (x,y rotation side)
C1  25.4,19.05 270 top
C2  31.11,29.84 90 top
C3  26.67,18.41 270 top
C4  31.75,18.41 90 top
C5  17.14,29.84 270 top
C6  10.79,8.26 90 top
C7  14.61,18.41 180 top
C8  37.47,22.86 0 top
C9  34.29,13.97 90 top
C10  14.61,23.5 180 top
C11  6.35,24.77 90 top
C12  9.53,23.5 0 top
C13  9.53,19.05 0 top
C14  21.59,16.51 180 top
C15  21.59,17.78 180 top
C16  20.95,6.99 270 top
C17  18.41,19.05 270 top
C18  14.61,31.11 270 top
C19  15.88,6.35 270 top
D1  2.54,8.89 270 top
D2  9.53,17.14 180 top
D3  36.2,5.71 0 top
D4  38.73,15.88 90 top
D5  2.54,6.6 90 top
E1  42.55,22.92 270 top
F1  9.53,25.4 0 top
FID1  40.64,5.08 0 top
FID2  5,37 0 top
FRAME1  -5.71,-22.23 0 top  (outside the outline)
IC1  22.23,31.11 270 top
JP1  6.35,12.7 90 top
JP2  8.26,2.54 180 top
JP3  8.26,6.99 0 top
JP4  13.34,2.54 180 top
JP5  13.34,6.99 0 top
JP6  18.41,2.54 180 top
JP7  18.41,6.99 0 top
JP8  23.5,2.54 180 top
JP9  23.5,6.99 0 top
JP10  28.57,2.54 180 top
JP11  28.57,6.99 0 top
JP12  33.66,2.54 180 top
JP13  33.66,6.99 0 top
JP14  38.61,9.91 0 top
JP15  2.03,20.95 0 top
JP16  8.26,39.37 0 top
JP17  8.26,34.92 0 top
JP18  13.34,39.37 0 top
JP19  13.34,34.92 0 top
JP20  18.41,39.37 0 top
JP21  18.41,34.92 0 top
JP22  23.5,39.37 0 top
JP23  23.5,34.92 0 top
JP24  28.57,39.37 0 top
JP25  28.57,34.92 0 top
JP26  33.66,39.37 0 top
JP27  33.66,34.92 0 top
JP28  31.11,34.92 0 top
JP29  4.83,31.37 90 top
JP30  1.27,27.94 90 top
L1  34.92,22.03 270 top
L2  40.01,22.03 270 top
LOGO1  47.62,9.97 90 top
LOGO2  39.37,26.04 90 top
LOGO3  39.37,17.78 0 bottom
Q1  13.97,14.61 180 top
Q2  27.94,13.97 0 top
Q3  31.75,13.97 0 top
R1  33.02,18.41 90 top
R2  5.71,8.89 180 top
R3  20.32,27.62 180 top
R4  24.13,27.62 180 top
R5  13.34,12.06 0 top
R6  13.34,12.06 0 top
R7  9.53,15.24 180 top
R8  34.29,27.94 90 top
R9  16.51,26.04 90 top
R10  34.29,18.41 270 top
R11  31.11,8.89 180 top
R12  5.08,6.35 90 top
R13  9.53,22.23 0 top
R14  9.53,20.32 0 top
R15  8.89,29.21 90 top
R16  8.89,32.38 270 top
R17  29.84,10.16 180 top
R18  29.84,11.43 0 top
R19  34.29,31.75 270 top
R20  21.59,35.56 270 top
S1  38.73,31.75 90 top
SJ1  13.34,12.06 180 bottom
SJ2  1.91,6.35 0 bottom
SJ3  38.61,13.72 90 bottom
SJ4  8.89,30.8 270 bottom
STANDOFF1  2.54,39.37 0 top
STANDOFF2  2.54,2.54 0 top
STANDOFF3  39.37,39.37 0 top
STANDOFF4  39.37,2.54 0 top
U1  13.97,9.53 270 top
U2  30.48,24.13 180 top
U3  14.61,20.95 270 top
U4  21.59,12.06 0 top
U5  21.59,23.5 90 top
U6  12.06,31.11 270 top
Y1  29.21,18.41 0 top

### Tracks (layer width: path | path; a pad name or v marks a point on that pad's centre or on a via)
0/BUTTON  (via drill 0.38)
  Top 0.203: U2.15 29.23,27.16 27.56,28.83 v27.56,29.77 | Q3.3 30.78,15.07 v30.71,15.01 | 35.81,32.6 v35.81,30.48 36.32,30.48 36.83,29.97 S1.1 | 35.81,34.54 35.81,33.02 35.81,32.6 | S1.2 35.81,34.54 | JP27.1 35.43,34.92 35.81,34.54 | R19.1 35.81,32.6
  Top 0.254: JP26.1@2 JP27.1
  Bottom 0.203: v27.56,29.77 31.61,29.77 33.78,31.94 34.35,31.94 v35.81,30.48 35.81,27.62 32.7,24.51 32.7,22.42 33.08,22.04 33.53,22.04 34.23,21.34 34.23,20.07 36.2,18.1 36.2,16.51 34.69,15.01 v30.71,15.01
2/SDA  (via drill 0.38)
  Top 0.203: U2.14 29.73,27.27 28.25,28.75 28.25,30.87 v27.05,32.07 | U6.DATA v11.06,28.64 10.79,28.36 R15.1 JP29.1 3.05,30.7 3.05,31.24 JP30.3
  Bottom 0.203: v27.05,32.07 14.49,32.07 v11.06,28.64
3.3V_F
  Top 0.254: U4.13 23.18,13.97 22.92,13.72 22.54,13.72 | 22.54,13.72 20,11.18 U4.3 20,8.79 C16.1 | U4.14 22.54,13.72
4/WS2812  (via drill 0.38)
  Top 0.203: U2.16 28.73,27.09 27.88,27.94 v27.3,27.94 | v35.52,17.82 36.16,18.45 D4.4
  Bottom 0.203: v35.52,17.82 33.85,19.49 33.85,21.14 33.34,21.65 32.89,21.65 32.32,22.23 32.32,24.7 34.48,26.86 34.48,30.48 34.16,30.8 33.27,30.8 31.75,29.27 28.57,29.27 28.57,29.21 v27.3,27.94
14/SCL  (via drill 0.38)
  Top 0.203: U2.9 32.23,27.34 32.32,27.43 32.32,32.07 v32.04,32.35 | R16.1 v10.16,33.23 10.96,33.23 11.06,33.13 U6.SCK | JP30.4 4.18,35.56 JP29.4
  Bottom 0.203: v32.04,32.35 29.88,32.35 29.5,32.73 10.67,32.73 v10.16,33.23 6.51,33.23 JP29.4
ADC  (via drill 0.38)
  Top 0.203: U2.6 34.02,24.88 v34.47,25.32 | IC1.7 26.04,31.75 26.86,30.92 v26.86,30.48 IC1.6
  Bottom 0.203: v34.47,25.32 36.51,27.37 36.51,30.8 34.92,32.38 33.66,32.38 31.75,30.48 v26.86,30.48
ADC-IN
  Top 0.203: IC1.3 18.22,30.48 18.03,30.67 18.03,34.54 JP21.1
  Top 0.254: JP20.1@2 JP21.1
CHIP_EN
  Top 0.203: U2.7 33.57,25.38 34.29,26.1 R8.1
D+
  Top 0.203: C13.1 R14.1 7.75,20.32 7.11,20.95 JP15.D+
D-
  Top 0.203: C12.1 R13.1 7.75,22.23 7.13,21.61 JP15.D-
DTR  (via drill 0.38)
  Top 0.203: U4.1 v18.73,10.54 | Q3.2 32.7,12.25 32.38,11.94 v32,11.94 32,10.73 31.43,10.16 R17.1
  Bottom 0.203: v18.73,10.54 19.05,10.54 19.88,9.72 29.78,9.72 v32,11.94
GND  (via drill 0.38)
  Top 0.356: U4.16 21.27,15.94 20.74,16.47 C14.2
  Top 0.406: JP15.GND 3.46,19.66 3.37,19.75 | C3.1 26.46,19.27 C1.2
  Top 0.762: E1.GND 41.3,24.1 40.64,24.77 40.64,26.04 40.91,26.3 E1.GND2
  other vias: 30.48,24.13 31.62,24.13 31.62,25.27 30.48,25.27 29.34,24.13 29.34,25.27 29.34,22.99 30.48,22.99 31.62,22.99 29.84,31.18 12.38,22.8 18.29,28.32 29.21,16.51 36.2,21.59 38.73,21.59 36.83,24.13 39.37,24.13 41.91,24.13 41.91,21.59 19.56,16.95 6.35,19.68 41.91,26.67 41.91,29.21 41.91,31.75 41.91,34.04 41.91,19.05 41.91,16.51 41.91,13.97 41.91,11.43 41.91,8.89 13.97,9.97 9.53,8.95 31.92,7.75 26.29,28.32 20.45,36.32
  pour Top (isolate 0.203, rank 6): 0,2.54 0,39.37 arc-90 2.54,41.91 39.37,41.91 arc-90 41.91,39.37 41.91,35.05 42.42,34.54 42.42,7.37 41.91,6.86 41.91,2.54 arc-90 39.37,0 2.54,0 arc-90
  pour Bottom (isolate 0.203, rank 6): 0,2.54 0,39.37 arc-90 2.54,41.91 39.37,41.91 arc-90 41.91,39.37 41.91,35.05 42.42,34.54 42.42,7.37 41.91,6.86 41.91,2.54 arc-90 39.37,0 2.54,0 arc-90
GPIO5  (via drill 0.38)
  Top 0.203: U2.24 27.52,22.38 v26.99,21.84 | v24.77,16.57 26.04,15.3 26.04,11.43 30.48,6.99 JP13.1 | D3.A 35.17,4.84 34.92,5.08 33.66,5.08
  Top 0.254: JP12.1@2 33.66,5.08 JP13.1
  Bottom 0.203: v26.99,21.84 26.86,21.84 24.77,19.75 v24.77,16.57
GPIO12  (via drill 0.38)
  Top 0.203: U2.10 31.73,27.41 31.94,27.62 31.94,31.5 30.29,33.15 v30.04,33.15
  Top 0.254: JP16.1@2 JP17.1
  Bottom 0.203: v30.04,33.15 11.43,33.15 9.65,34.92 JP17.1
GPIO13  (via drill 0.38)
  Top 0.203: U2.12 30.73,27.37 29.02,29.08 29.02,32.26 v27.43,33.85
  Top 0.254: JP18.1@2 JP19.1
  Bottom 0.203: v27.43,33.85 27.11,33.53 14.73,33.53 JP19.1
GPIO15  (via drill 0.38)
  Top 0.203: U2.13 30.23,27.33 28.63,28.93 28.63,31.7 v26.1,34.23 | R20.2 23.28,34.71 JP23.1
  Top 0.254: JP22.1@2 JP23.1
  Bottom 0.203: v26.1,34.23 25.4,34.92 JP23.1
GPIO16
  Top 0.203: U2.8 33.5,25.88 33.59,25.97 33.59,26.23 32.7,27.11 32.7,32.7 31.75,33.66 30.48,33.66 29.84,34.29 29.21,34.29 JP25.1
  Top 0.254: JP24.1@2 JP25.1
LNA
  pour Top (isolate 0.203, no thermals): 32.66,23.01 33.66,23.01 34.06,23.42 37.16,23.42 37.16,22.3 34.11,22.3 33.66,22.76 32.66,22.76
N$1
  Top 0.203: R1.2 33.02,19.49 31.73,20.79 U2.31
N$2
  Top 0.203: U2.28 30.23,20.57 30.39,20.41 Y1.3 31.73,19.29 C4.2
N$3
  Top 0.203: U2.27 29.73,20.27 29.21,19.75 29.21,18.71 Y1.1 26.7,17.54 C3.2
N$4  (via drill 0.38)
  Top 0.203: R13.2 v11.49,22.23 | U4.12 23.81,13.08 v23.75,13.02
  Bottom 0.203: v23.75,13.02 18.35,13.02 12.19,19.18 12.19,21.53 v11.49,22.23
N$5  (via drill 0.38)
  Top 0.203: D5.C 1.66,5.73 v0.89,4.95
  Bottom 0.203: v0.89,4.95 1.4,5.46 SJ2.2
N$6
  Top 0.203: R17.2 27.94,10.16 26.99,11.11 Q2.1
N$7  (via drill 0.38)
  Top 0.203: R14.2 v11.49,20.32 | v24.45,12.32 U4.11
  Bottom 0.203: v24.45,12.32 18.22,12.32 11.49,19.05 v11.49,20.32
N$8
  Top 0.203: R11.1 33.9,8.89 D3.C
N$9
  Top 0.254: R2.1 8.26,8.89 10.16,10.79 11.43,10.79 11.75,10.47 U1.1
N$10
  Top 0.254: D5.A 4.01,7.2 R12.2
N$11  (via drill 0.38)
  Top 0.203: R15.2 7.7,30.06 v7.62,29.98
  Bottom 0.203: SJ4.3 v7.62,29.98
N$12
  Top 0.203: R18.2 30.8,11.54 Q3.1
N$13  (via drill 0.38)
  Top 0.203: R16.2 7.64,31.54 v7.57,31.61
  Bottom 0.203: SJ4.1 v7.57,31.61
N$14
  Top 0.203: U1.5 16.06,10.47 16.19,10.6 16.19,11.05 15.84,11.41 R5.2
  Bottom 0.203: SJ1.2 R5.2
N$15
  Top 0.203: R3.2 19.47,28.3 19.68,28.51 20.95,28.51 21.34,28.89 21.34,31.75 | 21.34,31.75 21.34,32.64 20.95,33.02 IC1.1 | IC1.2 21.34,31.75
N$16  (via drill 0.38)
  Top 0.203: R6.2 15.24,13.12 v15.24,13.34
  Bottom 0.203: v15.24,13.34 13.11,13.34 12.83,13.06 SJ1.1
N$17
  Top 0.254: R2.2 D1.C
N$18
  Top 0.203: R3.1 22.23,27.62 | 22.23,27.62 R4.2 | IC1.5 22.86,29.21 22.23,28.57 22.23,27.62
N$19
  Bottom 0.406: JP14.1 36.61,12.38 37.44,13.21 SJ3.1
RESET  (via drill 0.38)
  Top 0.203: U2.32 32.23,20.86 32.89,20.19 34.23,20.19 34.29,20.13 R10.1 35.14,19.27 v35.56,19.68 | Q2.3 28.94,15.07 v29.34,14.67
  Bottom 0.203: v29.34,14.67 29.65,14.35 34.61,14.35 36.64,16.38 36.64,18.61 v35.56,19.68 34.61,20.64 34.61,21.53 33.72,22.42 33.27,22.42 33.08,22.61 33.08,23.56 33.66,24.13 34.29,24.13 36.89,26.73 36.89,31.05 34.29,33.66 32.38,33.66 JP28.1
RTS  (via drill 0.38)
  Top 0.203: v27.88,11.43 R18.1 28.89,11.54 Q2.2 | U4.2 19.37,10.1 19.43,10.16 19.43,11.18 v19.3,11.3
  Bottom 0.203: v27.88,11.43 26.54,10.1 20.38,10.1 19.3,11.18 v19.3,11.3
SD_!HD!
  Top 0.203: U5.7 19.39,22.86 21.3,24.77 25.78,24.77 26.4,25.38 U2.18
SD_!WP!
  Top 0.203: U2.19 26.47,24.88 25.72,24.13 U5.3
SD_CLK
  Top 0.203: R9.1 16.51,24.51 16.89,24.13 U5.6
SD_CLK0  (via drill 0.38)
  Top 0.203: U2.21 27.33,23.88 26.95,23.5 21.72,23.5 v21.34,23.88 | R9.2 v17.74,26.89
  Bottom 0.203: v21.34,23.88 21.34,25.84 20.57,26.61 18.02,26.61 v17.74,26.89
SD_CS0  (via drill 0.38)
  Top 0.203: U5.1 v23.3,21.59 | U2.20 26.89,24.38 v26.71,24.19
  Bottom 0.203: v23.3,21.59 24.11,21.59 v26.71,24.19
SD_SI  (via drill 0.38)
  Top 0.203: U5.5 v20.51,25.4 | U2.23 27.48,22.88 27.23,22.63 26.52,22.63 26.11,22.23 23.75,22.23 23.3,22.67 v20.51,22.67
  Bottom 0.203: v20.51,22.67 v20.51,25.4
SD_SO
  Top 0.203: U2.22 27.42,23.38 27.15,23.11 26.29,23.11 26.04,22.86 U5.2
SHIELD  (via drill 0.38)
  other vias: 2.03,24.64 2.03,20.95 2.03,17.27
  pour Bottom (isolate 0.203): 0,25.4 3.17,25.4 3.17,16.51 0,16.51
TRACE_ANT
  Top 0.406: E1.ANT 40.04,22.92 L2.1
  pour Top (isolate 0.203, no thermals): 37.77,23.42 41.99,23.42 arc-90 42.49,23.04 42.49,22.68 arc-90 42.01,22.28 37.77,22.28
U0RXI  (via drill 0.38)
  Top 0.203: U2.25 28.73,21.17 28,20.45 v27.81,20.45 | v18.73,15.88 U4.20 18.73,11.81 18.03,11.11 v18.03,8.57
  Top 0.254: JP8.1@2 JP9.1
  Bottom 0.203: v18.73,15.88 26.04,15.88 27.81,17.65 v27.81,20.45 | v18.03,8.57 18.35,8.26 22.23,8.26 JP9.1
U0TXO  (via drill 0.38)
  Top 0.203: U2.26 29.23,20.72 v28.96,20.45 | U4.4 20.64,10.73 v20.7,10.79 | v25.15,11.05 28.57,7.62 JP11.1
  Top 0.254: JP10.1@2 JP11.1
  Bottom 0.203: 24.67,11.53 25.15,12 25.15,14.35 28.96,18.16 v28.96,20.45 | 24.67,11.53 23.94,10.79 v20.7,10.79 | v25.15,11.05 24.67,11.53
V_BATT  (via drill 0.38)
  Top 0.406: Q1.3 11.6,13.51 11.16,13.06 v8.89,13.06 6.99,13.06 JP1.2 | U1.3 v13.97,8.57 | C6.1 11.66,7.41 v11.87,7.62
  Bottom 0.406: v13.97,8.57 11.87,8.57 | 11.87,8.57 8.89,11.56 v8.89,13.06 | v11.87,7.62 11.87,8.57
V_USB  (via drill 0.38)
  Top 0.254: D1.A 1.66,13.09 3.81,15.24 7.37,15.24
  Top 0.356: v22.44,18.86 C15.1 C14.1 21.91,15.98 U4.15 | v17.14,15.88 16.56,15.29
  Top 0.406: D2.A v7.37,17.14 7.37,15.24 7.37,14.64 8.04,13.97 8.68,13.97 | 8.68,13.97 10.79,13.97 11.43,14.61 13.92,14.61 Q1.1 16.24,15.61 16.56,15.29 16.83,15.02 16.83,8.57 | R7.2 8.68,13.97 | F1.2 v12.06,25.4 | C19.1 16.83,8.15 16.83,8.57 | U1.4 16.83,8.57
  Bottom 0.356: v22.44,18.86 18.86,18.86
  Bottom 0.406: v7.37,17.14 9.53,19.3 9.53,22.86 v12.06,25.4 | v17.14,15.88 17.14,17.14 18.86,18.86
VCC  (via drill 0.38)
  Top 0.254: U2.29 30.73,20.78 v31.04,20.47 31.23,20.66 U2.30 | U2.1 33.5,22.38 33.66,22.23 33.66,21.53 v33.08,20.95 | U2.11 31.23,27.81 v31.19,27.85 31.11,27.93 C2.1 | U2.17 27.21,25.88 27.02,26.07 v27.02,26.67 | U6.VDD 12.06,33.21 12.38,33.53 14.1,33.53 14.61,33.02 C18.1 15.66,31.96 15.88,31.75 v15.88,30.7 C5.1 | JP4.1@2 JP5.1 | U2.3 33.54,23.38 33.66,23.5 33.66,23.88 | v33.4,29.91 34.29,29.91 | 34.29,29.91 34.73,29.91 35.31,29.34 35.31,28.79 | 35.31,28.79 35.31,25.15 34.04,23.88 33.66,23.88 | R8.2 35.31,28.79 | R19.2 34.29,29.91 | U2.4 33.66,23.88 | R12.1 6.13,5.5 v6.35,5.71
  Top 0.406: R10.2 v34.29,16.32 35.12,16.32 36.07,15.37 36.07,13.3 | 36.07,13.12 36.07,11.94 34.08,9.95 v32.8,9.95 | U5.8 18.41,21.51 C17.1 | C17.1 C1.1 26.04,20.54 v26.5,20.54 | C17.1 17.57,19.9 16.51,20.95 16.13,20.95 15.9,21.18 U3.5 15.9,22.58 15.68,22.8 15.68,23.5 C10.1 15.46,24.42 15.24,24.64 v15.24,25.4 | v22.23,29.84 22.23,32.38 22.86,33.02 IC1.8 | 36.07,13.3 D4.1 38.19,13.3 38.61,13.72 v38.61,15.24 | C9.1 36.07,13.12 | 36.07,13.12 36.07,13.3
  Bottom 0.254: JP29.2 5.8,30.8 SJ4.2
  Bottom 0.406: v26.5,20.54 26.76,20.54 27.56,21.34 30.85,21.34 31.23,20.95 | v15.88,30.7 15.88,29.84 | v34.29,16.32 31.04,19.57 v31.04,20.47 31.23,20.66 31.23,20.95 | 15.88,29.84 v22.23,29.84 25.4,26.67 v27.02,26.67 27.94,26.67 29.12,27.85 v31.19,27.85 32.11,28.77 32.26,28.77 v33.4,29.91 | v33.08,20.95 31.23,20.95 | v32.8,9.95 30.48,7.62 30.48,6.35 29.53,5.4 13.34,5.4 | v15.24,25.4 15.24,26.67 | 15.24,26.67 15.24,29.21 15.88,29.84 | 13.34,5.4 6.67,5.4 v6.35,5.71 | JP5.1 13.34,5.4 | 3.81,30.37 3.81,27.18 4.32,26.67 15.24,26.67 | JP30.2 2.54,30.48 2.65,30.37 3.81,30.37 | 3.81,30.37 JP29.2 | v38.61,15.24 SJ3.2
VIN  (via drill 0.38)
  Top 0.254: JP2.1@2 JP3.1
  Top 0.406: D2.C v11.68,17.14 13.02,17.14 | U3.1 14.16,21.91 14.41,21.65 14.41,20 | 14.41,20 14.41,19.75 15.51,18.66 C7.1 15.51,17.47 15.18,17.14 13.02,17.14 | U3.3 14.41,20 | Q1.2 13.02,17.14
  Bottom 0.406: JP3.1 4.45,10.79 4.45,14.61 5.71,15.88 10.41,15.88 v11.68,17.14
VUSB
  Top 0.406: JP15.VBUS 5.87,22.25 6.35,22.73 C11.1 6.96,23.91 8.12,25.08 F1.1
WS2812-DOUT
  Top 0.203: D4.2 40.34,11.37 40.61,11.1 JP14.3

### Text on the board
Bottom: v10
tPlace: 12 | 13 | ADC | 15 | 16 | RST | 0 | 0 | Blynk Board - ESP8266 | 4 | CHG | PWR | VIN | 3.3V | GND | RX | TX | 5
bPlace: 12 | 13 | ADC | 15 | 16 | RST | 0 | SCL | SDA | GND | I2C / PU | 3V3 | SDA | GND | Blynk Board - ESP8266 | WS2812 / VCC | CHG / RES | 3.3V | GND | DOUT | PWR / LED | VIN | 3.3V | GND | RX | TX | 5
Measures: Units in inches
tDocu: Jim Lindblom